# EAGLE schematic RC (EAGLE 7.1.0)
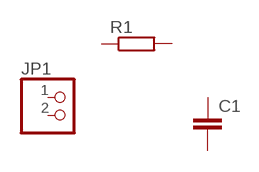
[diagram p0: schematic, sheet 1]

## Parts
C1  C-EU025-024X044  [C025-024X044]
JP1  PINHD-1X2  [1X02]
R1  R-EU_0204/2V  [0204V]
Unconnected: C1.1 C1.2 JP1.1 JP1.2 R1.1 R1.2

## Library data of the parts
C1 = rcl:C-EU: CAPACITOR, European symbol
JP1 = pinhead:PINHD-1X2: PIN HEADER
R1 = rcl:R-EU_: RESISTOR, European symbol